# EasyEDA schematic NEURON-Z1_EASYEDA.json
TITLE: Sheet_1; REV: 1.0; Date: 2021-09-27; Sheet: 1/1; Drawn By: Jeremy Littler; Company: BrainBoardz Inc.
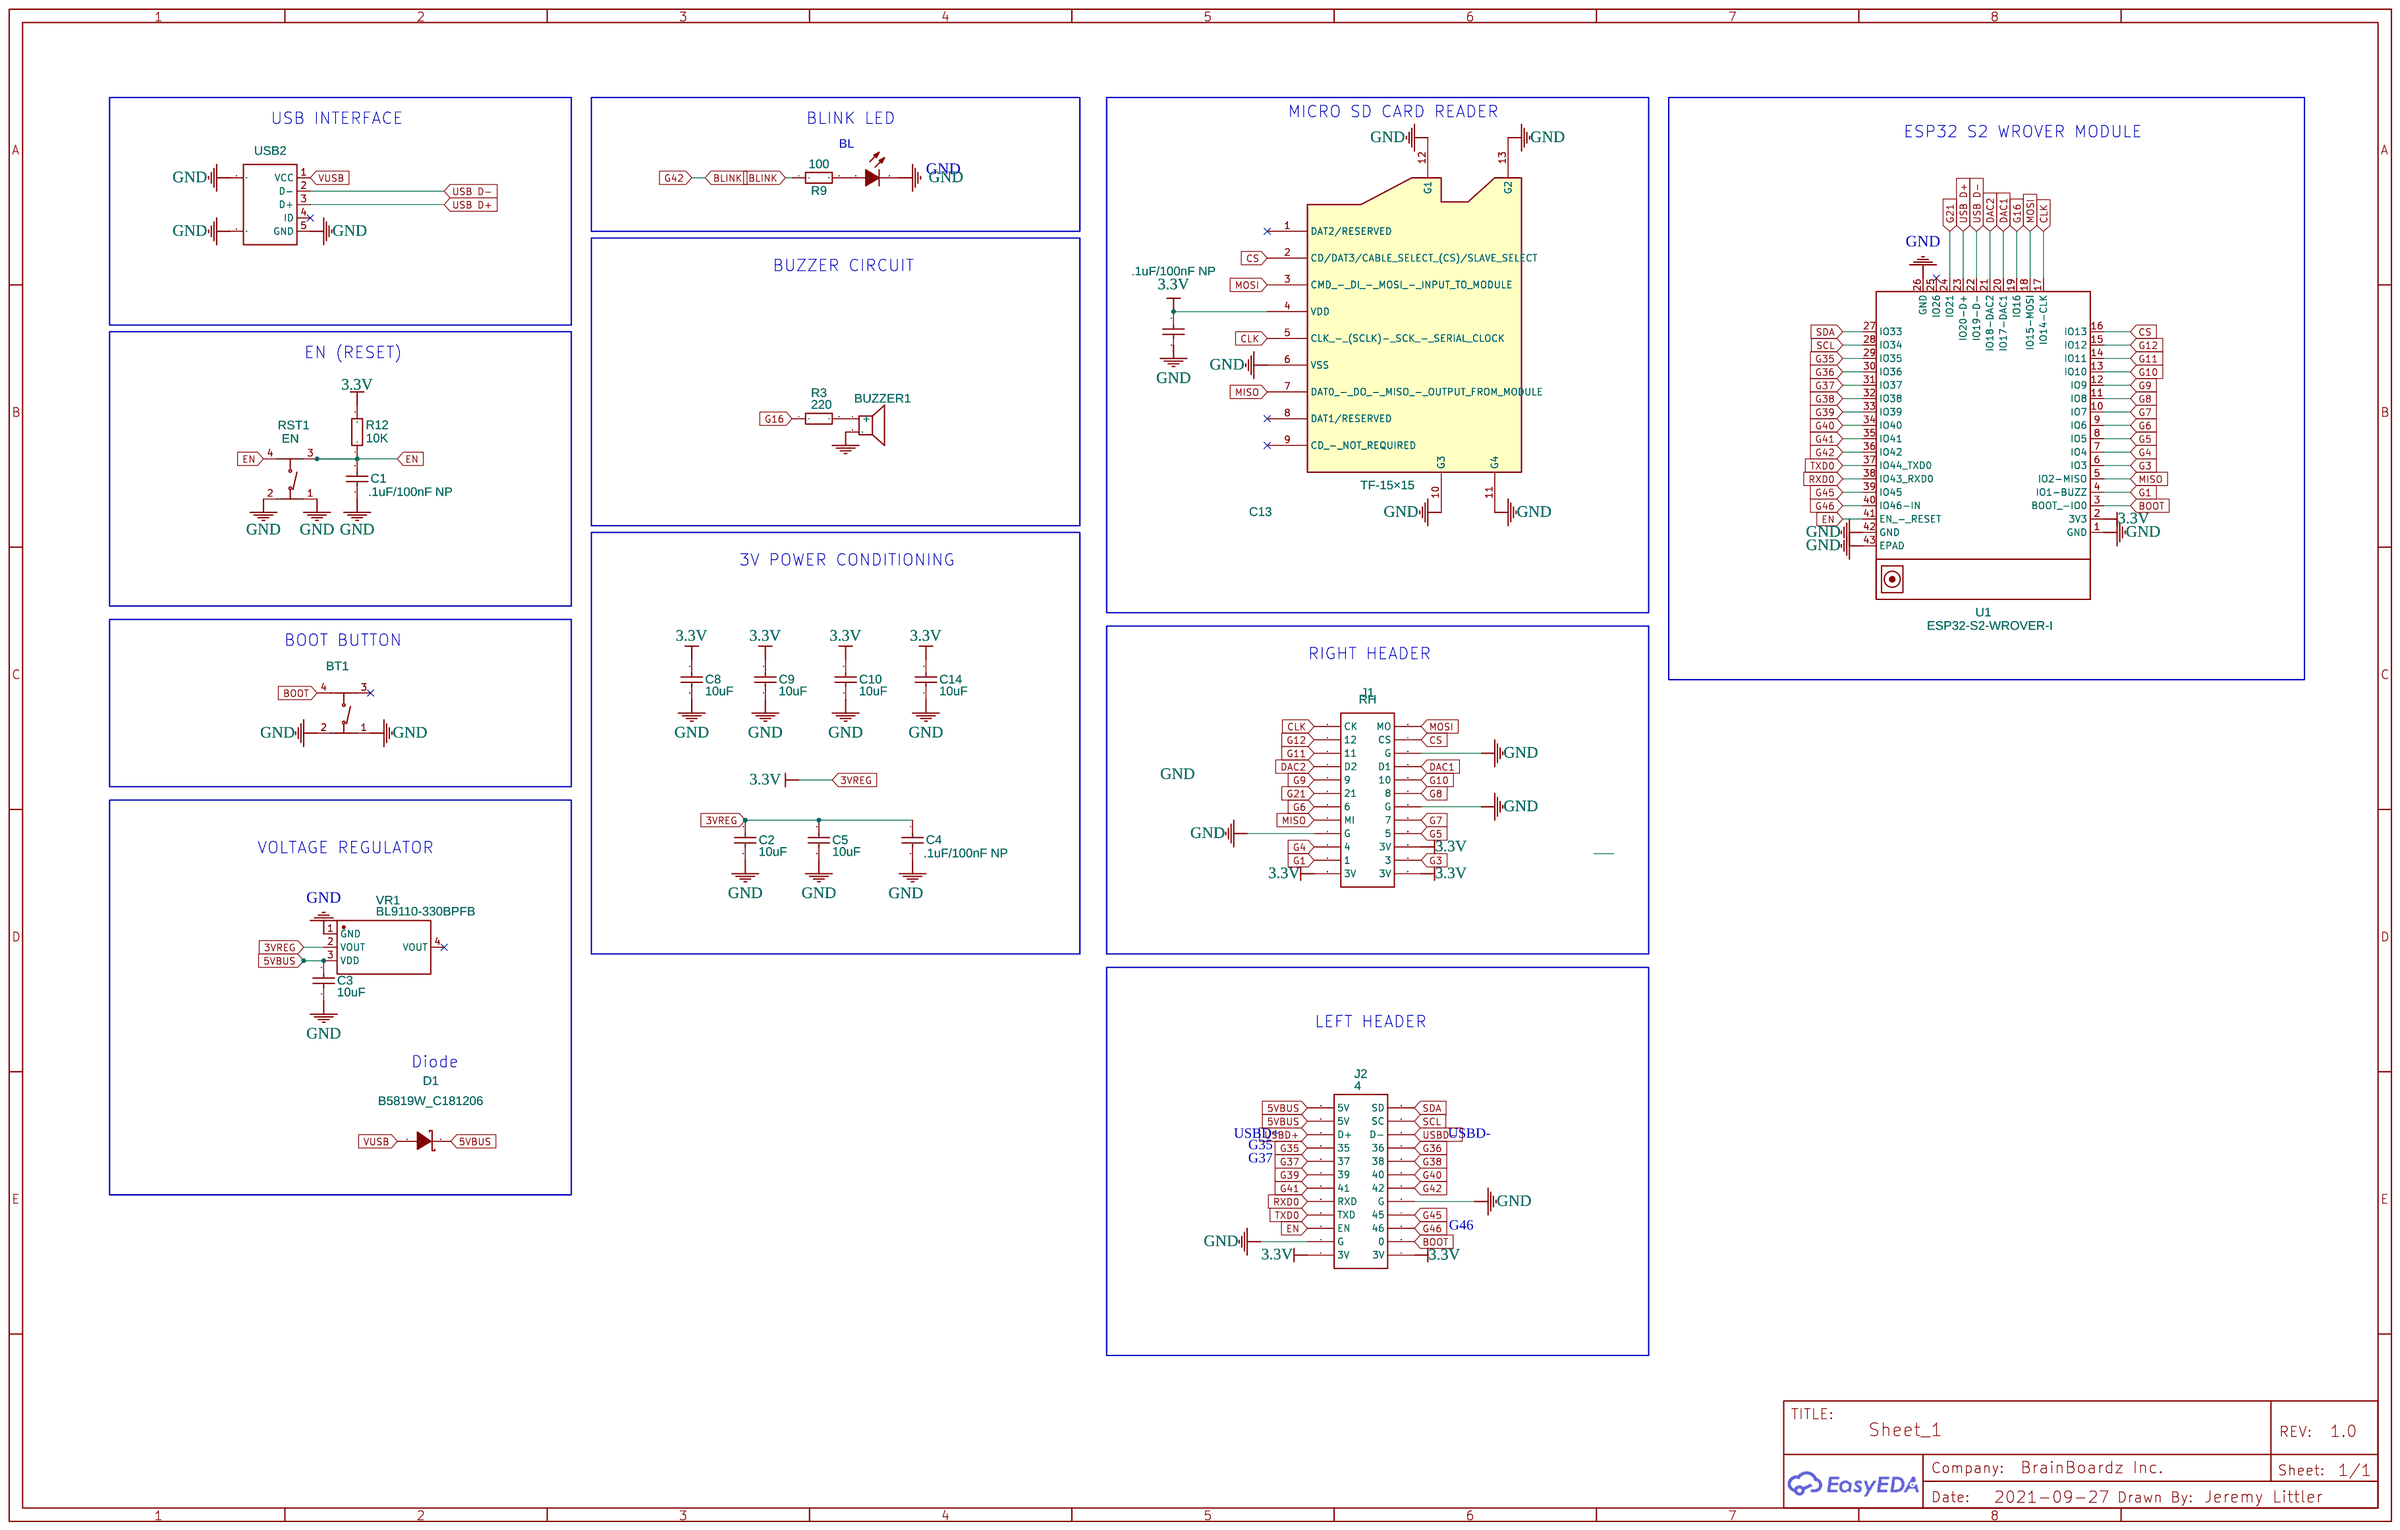
[diagram p0: schematic sheet]

## Parts
BLINK1  15-21SYGC/S530-E2/TR8  [LED1206-R-RD]
BT1  BOOT  [SW-SMD_4P-L5.1-W5.1-P3.70-LS6.4]
BUZZER1  PS1240P02CT3  [BUZ-TH_BD12.5-P5.00-D0.9]
C1  .1uF/100nF NP  [C1206]
C2  10uF  [C1206]
C3  10uF  [C1206]
C4  .1uF/100nF NP  [C1206]
C5  10uF  [C1206]
C8  10uF  [C1206]
C9  10uF  [C1206]
C10  10uF  [C1206]
C13  .1uF/100nF NP  [C1206]
C14  10uF  [C1206]
D1  B5819W_C181206  [SOD-123_L2.8-W1.8-LS3.7-RD]
J1  RH  [HDR-12X2/2.54]
J2  4  [HDR-12X2/2.54]
MICROSD1  TF-15×15  [TF-SMD_TF-15×15]
R3  220  [R1206]
R9  100  [R1206]
R12  10K  [R1206]
RST1  EN  [SW-SMD_4P-L5.1-W5.1-P3.70-LS6.4]
U1  ESP32-S2-WROVER-I  [ESP32-S2-WROVER]
USB2  Mini USB-B 5P-Female-TH_C46398  [MINI-USB-TH_USB-MINI-2]
VR1  BL9110-330BPFB  [SOT-223_L6.5-W3.5-P2.30-LS7.0-BR]

## Library data of the parts
BLINK1 = 15-21SYGC/S530-E2/TR8: Supplier: LCSC; Manufacturer: EVERLIGHT; image: //image.lceda.cn/szlcsc/C73550.jpg; Supplier Part: C73550; LCSC Assembly: Yes; SMT Type: Extend
BT1 RST1 = TS-1187A-C-E-B: Supplier: LCSC; Supplier Part: C318887; Manufacturer: XKB Enterprise; Contributor: LCSC; LCSC Assembly: Yes; SMT Type: Extend
BUZZER1 = PS1240P02CT3: Supplier: LCSC; Manufacturer: TDK; Supplier Part: C76873; LCSC Assembly: Yes; SMT Type: Extend
C1 C4 C13 = CL31B104KBCNNNC: Supplier: LCSC; Manufacturer: SAMSUNG; LCSC Assembly: Yes; Supplier Part: C24497; SMT Type: Basic
C2 C3 C5 C8-C10 C14 = CL31A106KBHNNNE: Supplier: LCSC; Manufacturer: SAMSUNG; Supplier Part: C13585; SMT Type: Basic; JLCPCB SMD: Yes
D1 = B5819W_C181206: Supplier: LCSC; Manufacturer: Hottech; Manufacturer Part: B5819W; Contributor: LCSC; Supplier Part: C181206; JLCPCB Part Class: Extended Part
J1 J2 = HDR 2.54mm 2x12: Manufacturer Part: New SchematicLib; Contributor: pojtrot
MICROSD1 = TF-15×15: Supplier: LCSC; Manufacturer: SOFNG; Supplier Part: C111196
R3 = 1206W4J0221T5E: Supplier: LCSC; Manufacturer: UniOhm; Supplier Part: C25363; JLCPCB Part Class: Extended Part
R9 = 1206W4F1000T5E: Supplier: LCSC; Manufacturer: UniOhm; LCSC Assembly: Yes; Supplier Part: C17901; SMT Type: Basic
R12 = AECR1206F10K0K9: Supplier: LCSC; Supplier Part: C328409; Manufacturer: ResistorToday; Contributor: LCSC; JLCPCB Part Class: Extended Part
U1 = ESP32-S2-WROVER-I: Manufacturer: Espressif Systems; link: https://www.mouser.com/ProductDetail/Espressif-Systems/ESP32-S2-WROVER?qs=sGAEpiMZZMu3sxpa5v1qrtBZTdlU4H0ZBUr%252Bcb7m5M4%3D; Contributor: fabiano.riccardi
USB2 = Mini USB-B 5P-Female-TH_C46398: Supplier: LCSC; Manufacturer: ValuePro; Manufacturer Part: MINI 5PFemale90Degree plate four feet copper shell LCPVinyl; image: //image.lceda.cn/szlcsc/C46398.jpg; Supplier Part: C46398
VR1 = BL9110-330BPFB: Supplier: LCSC; Manufacturer: BL; Contributor: LCSC; Supplier Part: C169246; JLCPCB Part Class: Extended Part

## Nets
3.3V: C2.2 C4.1 C5.2 C8.2 C9.2 C10.2 C13.2 C14.2 J1.20(3V) J1.23(3V) J1.24(3V) J2.1(3V) J2.2(3V) MICROSD1.4(VDD) R12.2 U1.2(3V3) VR1.2(VOUT)
5VBUS: C3.2 D1.1(K) J2.22(5V) J2.24(5V) VR1.3(VDD)
GND: BLINK1.2(C) BT1.1(A) BT1.2(B) BUZZER1.2 C1.2 C2.1 C3.1 C4.2 C5.1 C8.1 C9.1 C10.1 C13.1 C14.1 J1.6(G) J1.14(G) J1.17(G) J2.4(G) J2.9(G) MICROSD1.6(VSS) MICROSD1.10(G3) MICROSD1.11(G4) MICROSD1.12(G1) MICROSD1.13(G2) RST1.1(A) RST1.2(B) U1.1(GND) U1.26(GND) U1.42(GND) U1.43(EPAD) USB2.0 USB2.5(GND) VR1.1(GND)
BLINK: J2.11(42) R9.1 U1.36(IO42)
BOOT: BT1.4(D) J2.3(0) U1.3(BOOT -IO0)
CLK: J1.1(CK) MICROSD1.5(CLK - (SCLK)- SCK - SERIAL CLOCK) U1.17(IO14-CLK)
CS: J1.4(CS) MICROSD1.2(CD/DAT3/CABLE SELECT (CS)/SLAVE SELECT) U1.16(IO13)
DAC1: J1.8(D1) U1.20(IO17-DAC1)
DAC2: J1.7(D2) U1.21(IO18-DAC2)
EN: C1.1 J2.6(EN) R12.1 RST1.3(C) RST1.4(D) U1.41(EN - RESET)
G1: J1.21(1) U1.4(IO1-BUZZ)
G3: J1.22(3) U1.6(IO3)
G4: J1.19(4) U1.7(IO4)
G5: J1.18(5) U1.8(IO5)
G6: J1.13(6) U1.9(IO6)
G7: J1.16(7) U1.10(IO7)
G8: J1.12(8) U1.11(IO8)
G9: J1.9 U1.12(IO9)
G10: J1.10 U1.13(IO10)
G11: J1.5(11) U1.14(IO11)
G12: J1.3(12) U1.15(IO12)
G16: R3.1 U1.19(IO16)
G21: J1.11(21) U1.24(IO21)
G35: J2.18(35) U1.29(IO35)
G36: J2.17(36) U1.30(IO36)
G37: J2.16(37) U1.31(IO37)
G38: J2.15(38) U1.32(IO38)
G39: J2.14(39) U1.33(IO39)
G40: J2.13(40) U1.34(IO40)
G41: J2.12(41) U1.35(IO41)
G45: J2.7(45) U1.39(IO45)
G46: J2.5(46) U1.40(IO46-IN)
MISO: J1.15(MI) MICROSD1.7(DAT0 - DO - MISO - OUTPUT FROM MODULE) U1.5(IO2-MISO)
MOSI: J1.2(MO) MICROSD1.3(CMD - DI - MOSI - INPUT TO MODULE) U1.18(IO15-MOSI)
RXD0: J2.10(RXD) U1.38(IO43 RXD0)
SCL: J2.21(SC) U1.28(IO34)
SDA: J2.23(SD) U1.27(IO33)
TXD0: J2.8(TXD) U1.37(IO44 TXD0)
USB D+: U1.23(IO20-D+) USB2.3(D+)
USB D-: U1.22(IO19-D-) USB2.2(D-)
USBD+: J2.20(D+)
USBD-: J2.19(D-)
VUSB: D1.2(A) USB2.1(VCC)
Net-(BLINK1-1): BLINK1.1(A) R9.2
Net-(BUZZER1-1): BUZZER1.1(+) R3.2

Not connected (* = marked no-connect by the designer): BT1 3(C)*; MICROSD1 1(DAT2/RESERVED)* 8(DAT1/RESERVED)* 9(CD - NOT REQUIRED)*; U1 25(IO26)*; USB2 4(ID)*; VR1 4(VOUT)*

## Notes on the sheet
- USB INTERFACE
- BLINK LED
- MICRO SD CARD READER
- ESP32 S2 WROVER MODULE
- BL
- GND
- BUZZER CIRCUIT
- EN (RESET)
- 3V POWER CONDITIONING
- BOOT BUTTON
- RIGHT HEADER
- VOLTAGE REGULATOR
- LEFT HEADER
- Diode
- USBD+
- USBD-
- G35
- G37
- G46
